# EAGLE design LimitSwitch (EAGLE 8.0.1)
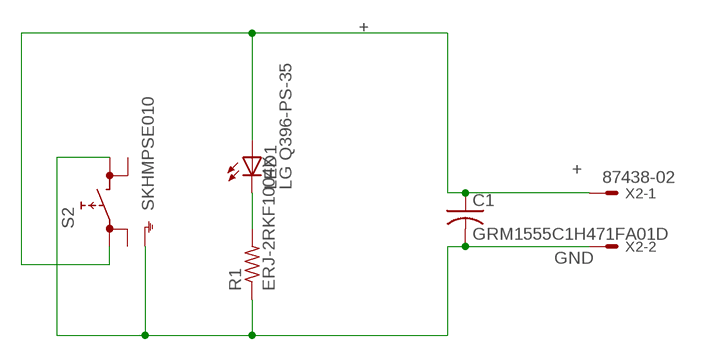
[diagram p0: schematic, sheet 1]

## Parts
C1  GRM1555C1H471FA01D  C-USC0402  [C0402]
LED1  LG Q396-PS-35  LEDCHIPLED_0603  [CHIPLED_0603]
R1  ERJ-2RKF1004X  R-US_R0402  [R0402]
S2  SKHMPSE010  [SKHMPXE010]
X2  87438-02  [87438-02]

## Nets
+: C1.1 LED1.A S2.1(1.1) X2.1
GND: C1.2 R1.1 S2.3(2.1) S2.5(SH) X2.2
N$1: LED1.C R1.2
Unconnected: S2.2(1.2) S2.4(2.2)

## Library data of the parts
C1 = resistor:C-US: CAPACITOR, American symbol
LED1 = led:LED: LED OSRAM: - CHIPLED LG R971, LG N971, LY N971, LG Q971, LY Q971, LO R971, LY R971 LH N974, LH R974 LS Q976, LO Q976, LY Q976 LO Q996 - Hyper CHIPLED LW Q18S LB Q993, LB Q99A, LB R99A - SideLED LS A670, LO A670, LY A670, LG A670, LP A670 LB A673, LV A673, LT A673, LW A673 LH A674 LY A675 LS A676, LA A676, LO A676, LY A676, LW A676 LS A679, LY A679, LG A679 - Hyper Micro SIDELED® LS Y876, LA Y876, LO Y876, LY Y876 LT Y87S - SmartLED LW L88C, LW L88S LB L89C, LB L89S, LG L890 LS L89K, LO L89K, LY L89K LS L896, LA L896, LO L896, LY L896 - TOPLED LS T670, LO T670, LY T670, LG T670, LP T670 LSG T670, LSP T670, LSY T670, LOP T670, LYG T670 LG T671, LOG T671, LSG T671 LB T673, LV T673, LT T673, LW T673 LH T674 LS T676, LA T676, LO T676, LY T676, LB T676, LH T676, LSB T676, LW T676 LB T67C, LV T67C, LT T67C, LS T67K, LO T67K, LY T67K, LW E67C LS E67B, LA E67B, LO E67B, LY E67B, LB E67C, LV E67C, LT E67C LW T67C LS T679, LY T679, LG T679 LS T770, LO T770, LY T770, LG T770, LP T770 LB T773, LV T773, LT T773, LW T773 LH T774 LS E675, LA E675, LY E675, LS T675 LS T776, LA T776, LO T776, LY T776, LB T776 LHGB T686 LT T68C, LB T68C - Hyper Mini TOPLED® LB M676 - Mini TOPLED Santana® LG M470 LS M47K, LO M47K, LY M47K Source: http://www.osram.convergy.de LUXEON: - LUMILED® LXK2-PW12-R00, LXK2-PW12-S00, LXK2-PW14-U00, LXK2-PW14-V00 LXK2-PM12-R00, LXK2-PM12-S00, LXK2-PM14-U00 LXK2-PE12-Q00, LXK2-PE12-R00, LXK2-PE12-S00, LXK2-PE14-T00, LXK2-PE14-U00 LXK2-PB12-K00, LXK2-PB12-L00, LXK2-PB12-M00, LXK2-PB14-N00, LXK2-PB14-P00, LXK2-PB14-Q00 LXK2-PR12-L00, LXK2-PR12-M00, LXK2-PR14-Q00, LXK2-PR14-R00 LXK2-PD12-Q00, LXK2-PD12-R00, LXK2-PD12-S00 LXK2-PH12-R00, LXK2-PH12-S00 LXK2-PL12-P00, LXK2-PL12-Q00, LXK2-PL12-R00 Source: www.luxeon.com KINGBRIGHT: KA-3528ASYC Source: www.kingbright.com
R1 = resistor:R-US_: RESISTOR, American symbol
S2 = switch:SKHMP*E010: 6.2 X 6.5mm TACT Switch (SMD) Source: http://www3.alps.co.jp/WebObjects/catalog.woa/PDF/E/Switch/Tact/SKHM/SKHM.PDF
X2 = con-molex:87438-02: Wire-to-Board 1.50mm (.059") Pitch Header - Right Angle, SMT, Shrouded Source: http://www.molex.com/product/micro/87438.html; OC_FARNELL: 1711327; OC_NEWARK: unknown

## Board
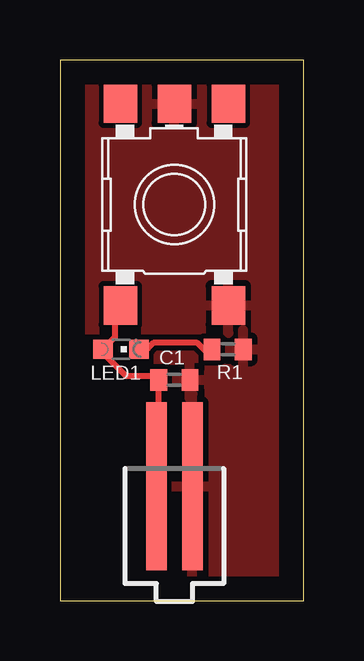
[diagram p1: board, top side]

Size 10.15 x 22.53 mm. Coordinates in mm from the lower left corner, seen from the top.
Outline: 0,0 10.15,0 10.15,22.53 0,22.53 0,0
Copper layers (1*16): Top 0.035mm / dielectric 1.5mm / Bottom 0.035mm
Design rules "default": minimum track width 10mil, minimum drill 24mil, track to track 8mil, track to pad 8mil, pad to pad 8mil, via to via 8mil, smd to smd 8mil, copper to edge 40mil, drill to drill 8mil, minimum pad ring 10mil, minimum via ring 8mil, stop-mask expansion 4mil, vias tented up to drill 0mil, thermal gap 10mil

### Footprints (pad centres in the part's own frame; a part is rotated, then mirrored left to right if it is on the bottom)
C0402 = smd 0.7 x 0.9: 1 -0.65,0; 2 0.65,0
CHIPLED_0603 = smd 0.8 x 0.8: A 0,-0.75; C 0,0.75
R0402 = smd 0.7 x 0.9: 1 -0.65,0; 2 0.65,0
SKHMPXE010 = smd 1.6 x 1.4: 1 -4.2,2.25; 2 4.2,2.25; 3 -4.2,-2.25; 4 4.2,-2.25; 5 4.2,0
87438-02 = smd 7 x 0.85: 1 0,0.75; 2 0,-0.75

### Placement (x,y rotation side)
C1  4.76,9.21 0 top
LED1  2.54,10.48 270 top
R1  6.99,10.48 180 top
S2  4.76,16.51 90 top
X2  4.76,4.76 90 top

### Tracks (layer width: path | path; a pad name or v marks a point on that pad's centre or on a via)
+
  Top 0.254: S2.1 2.29,12.12 2.29,10.97 1.83,10.52 LED1.A 1.83,10.29 2.74,9.37 3.89,9.37 C1.1 4.12,9.14 4.12,4.8 X2.1
GND
  pour Top: 0,22.54 0,0 10.16,0 10.16,22.54
N$1
  Top 0.254: LED1.C 3.43,10.52 3.66,10.52 3.89,10.74 5.71,10.74 6.17,10.29 R1.2